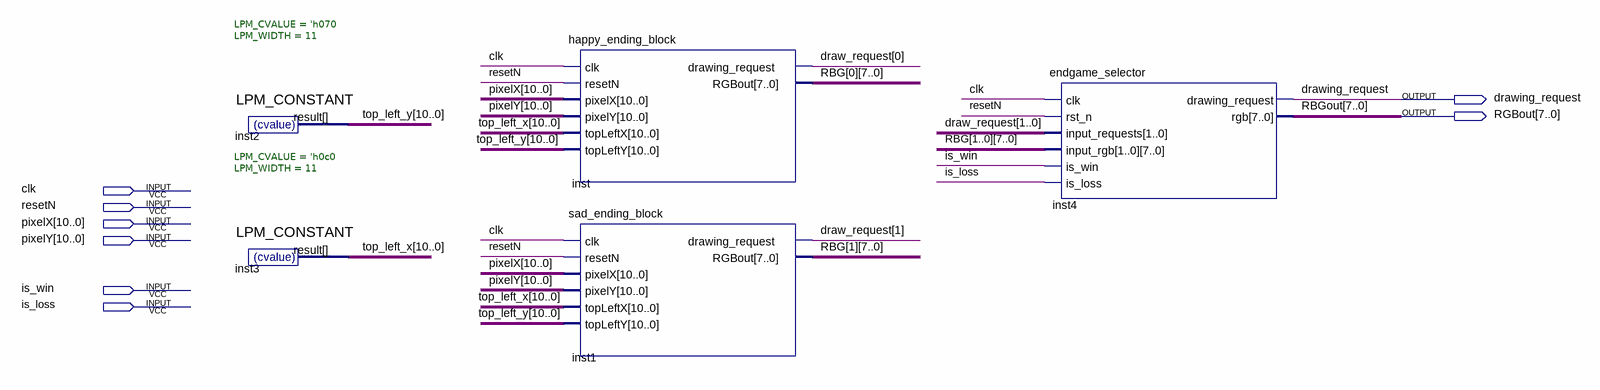
[diagram p0: schematic sheet]
// Quartus schematic endgame_display.bdf as structural Verilog: 5 symbols, 8 pins
module endgame_display (
  input  clk,
  input  resetN,
  input  [10:0] pixelX,
  input  [10:0] pixelY,
  input  is_win,
  input  is_loss,
  output drawing_request,
  output [7:0] RGBout
);

  wire [1:0] draw_request;
  wire [7:0] RBG_0, RBG_1;
  wire [10:0] top_left_x, top_left_y;

  LPM_CONSTANT #(.LPM_CVALUE('h070), .LPM_WIDTH(11)) inst2 (.result(top_left_y));
  LPM_CONSTANT #(.LPM_CVALUE('h0c0), .LPM_WIDTH(11)) inst3 (.result(top_left_x));
  happy_ending_block inst (
    .clk(clk), .resetN(resetN), .pixelX(pixelX), .pixelY(pixelY), .topLeftX(top_left_x),
    .topLeftY(top_left_y), .drawing_request(draw_request[0]), .RGBout(RBG_0));
  sad_ending_block inst1 (
    .clk(clk), .resetN(resetN), .pixelX(pixelX), .pixelY(pixelY), .topLeftX(top_left_x),
    .topLeftY(top_left_y), .drawing_request(draw_request[1]), .RGBout(RBG_1));
  endgame_selector inst4 (
    .clk(clk), .rst_n(resetN), .input_requests(draw_request), .input_rgb({RBG_1, RBG_0}), .is_win(is_win),
    .is_loss(is_loss), .drawing_request(drawing_request), .rgb(RGBout));

  // Other names for the same wires on the sheet: RBGout[7:0] = RGBout
endmodule
